# EAGLE design main (EAGLE 9.6.0)
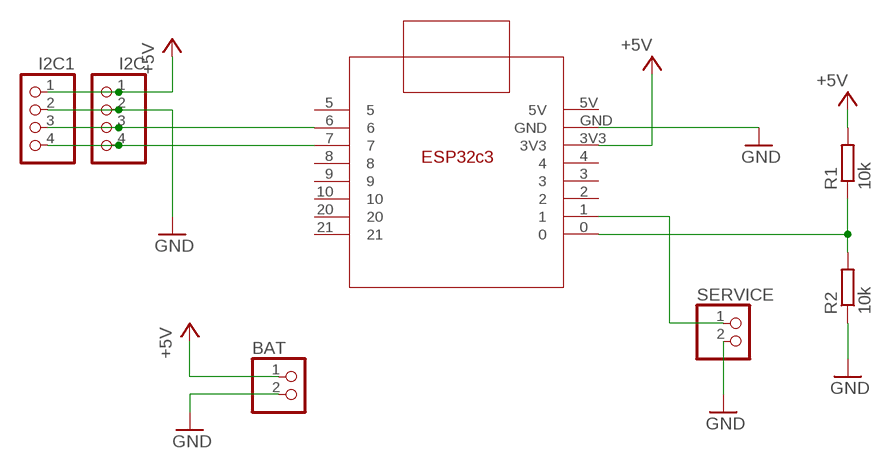
[diagram p0: schematic, sheet 1]

## Parts
BAT  PINHD-1X2  [1X02]
I2C  PINHD-1X4  [1X04]
I2C1  PINHD-1X4  [1X04]
R1  10k  R-EU_R0805  [R0805]
R2  10k  R-EU_R0805  [R0805]
SERVICE  PINHD-1X2  [1X02]
U$2  ESP32C3SMD  [ESP32C3_SMD]

## Nets
+5V: BAT.1 I2C1.1 I2C.1 R1.2 U$2.3V3
GND: BAT.2 I2C1.2 I2C.2 R2.1 SERVICE.2 U$2.GND
N$1: I2C1.3 I2C.3 U$2.6
N$2: R1.1 R2.2 U$2.0
N$3: I2C1.4 I2C.4 U$2.7
N$4: SERVICE.1 U$2.1
Unconnected: U$2.2 U$2.3 U$2.4 U$2.5 U$2.5V U$2.8 U$2.9 U$2.10 U$2.20 U$2.21

## Library data of the parts
BAT SERVICE = pinhead:PINHD-1X2: PIN HEADER
I2C I2C1 = pinhead:PINHD-1X4: PIN HEADER
R1 R2 = resistor:R-EU_: RESISTOR, European symbol
U$2 = ESP32:ESP32C3

## Board
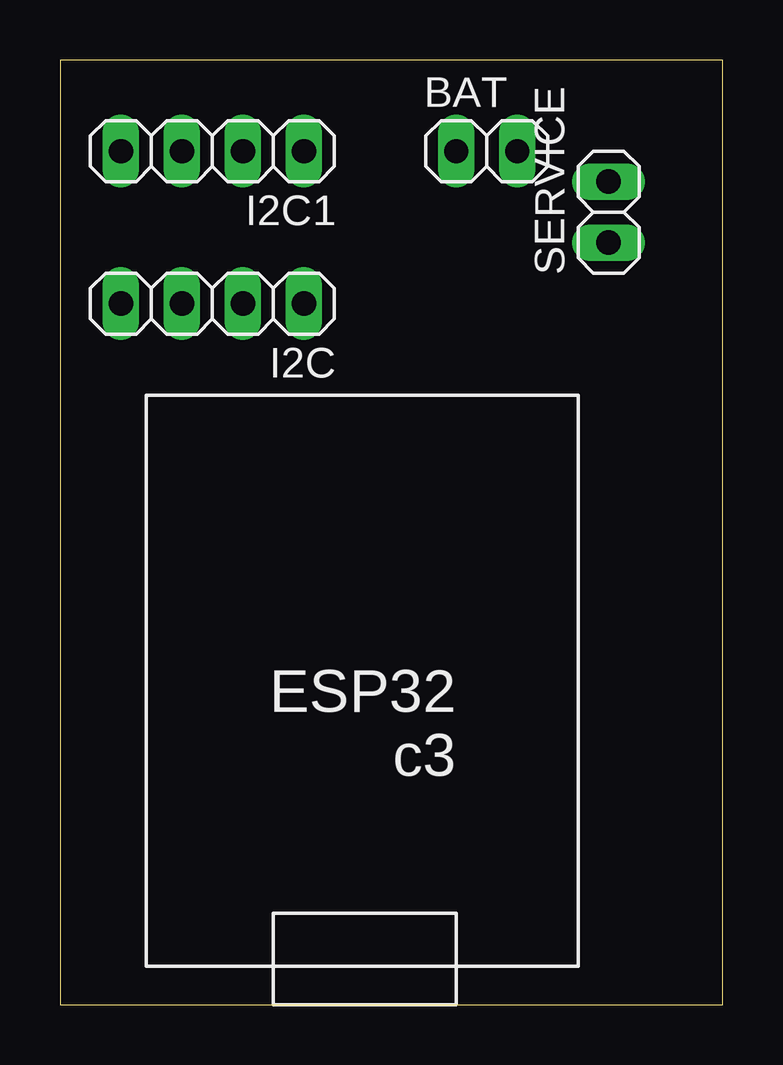
[diagram p1: board, top side]
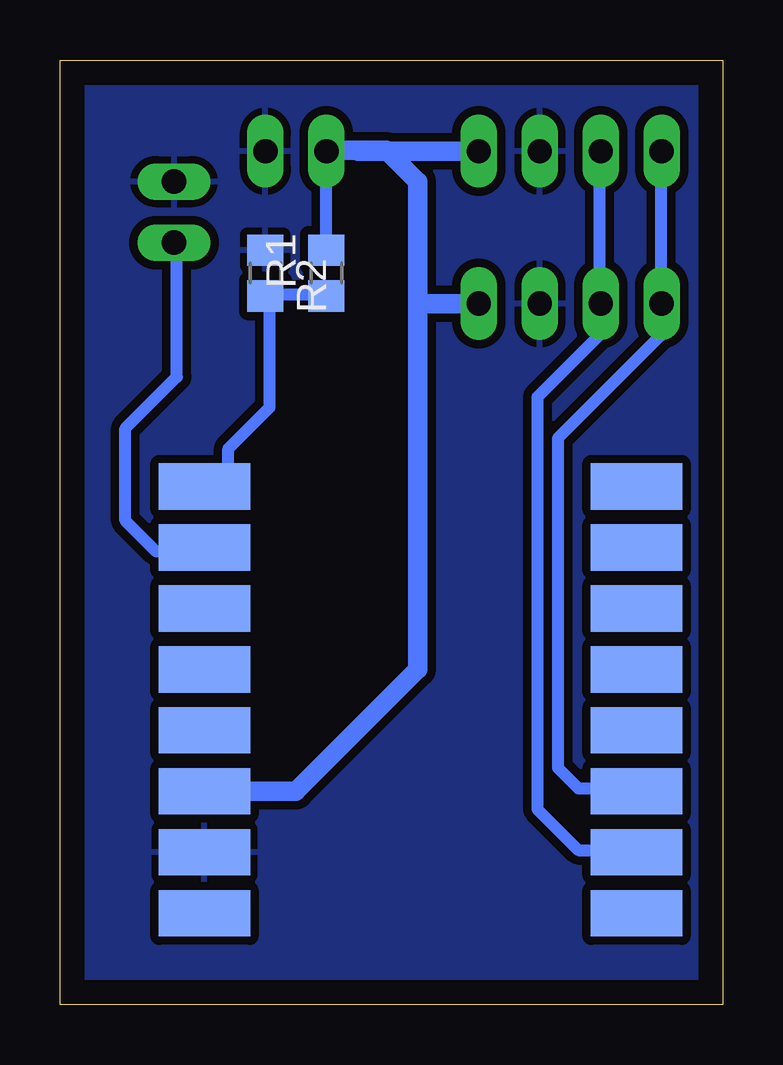
[diagram p2: board, bottom side, seen from below]

Size 27.61 x 39.36 mm. Coordinates in mm from the lower left corner, seen from the top.
Outline: 0,0 27.61,0 27.61,39.36 0,39.36 0,0
Copper layers (1*16): Top 0.035mm / dielectric 1.5mm / Bottom 0.035mm
Design rules "cnc": minimum track width 20mil, minimum drill 0.35mm, track to track 0.35mm, track to pad 0.35mm, pad to pad 0.35mm, via to via 0.35mm, smd to smd 0.35mm, copper to edge 40mil, drill to drill 6mil, minimum pad ring 10mil, minimum via ring 8mil, stop-mask expansion 4mil, vias tented up to drill 0mil, thermal gap 0.3mm

### Footprints (pad centres in the part's own frame; a part is rotated, then mirrored left to right if it is on the bottom)
1X02 = drill 1.016 long: 1 -1.27,0; 2 1.27,0
1X04 = drill 1.016 long: 1 -3.81,0; 2 -1.27,0; 3 1.27,0; 4 3.81,0
R0805 = smd 1.3 x 1.5: 1 -0.95,0; 2 0.95,0
ESP32C3_SMD = smd 3.81 x 1.93 bottom: 0 0,2.54; 1 0,5.08; 2 0,7.62; 3 0,10.16; 3V3 0,15.24; 4 0,12.7; 5 18,20.32; 5V 0,20.32; 6 18,17.78; 7 18,15.24; 8 18,12.7; 9 18,10.16; 10 18,7.62; 20 18,5.08; 21 18,2.54; GND 0,17.78

### Placement (x,y rotation side)
BAT  17.78,35.56 0 top
I2C  6.35,29.21 180 top
I2C1  6.35,35.56 180 top
R1  16.51,30.48 90 bottom
R2  19.05,30.48 270 bottom
SERVICE  22.86,33.02 90 top
U$2  21.59,24.13 180 top

### Tracks (layer width: path | path; a pad name or v marks a point on that pad's centre or on a via)
+5V
  Bottom 0.508: 16.3,35.61 BAT.1 R1.2
  Bottom 0.813: U$2.3V3 17.78,8.89 12.7,13.97 12.7,29.21 | 12.7,29.21 I2C.1 | 12.7,29.21 12.7,34.29 14.02,35.61 15.24,35.61 | 15.24,35.61 16.3,35.61 | I2C1.1 15.19,35.56 15.24,35.61
GND
  pour Bottom: 0,0 0,60.96 67.31,60.96 67.31,0
N$1
  Bottom 0.508: 5.15,29.17 5.15,27.89 7.72,25.31 7.72,8.15 6.01,6.43 3.86,6.43 U$2.6 | 5.15,29.17 I2C.3 | I2C1.3 5.15,35.49 5.15,29.17
N$2
  Bottom 0.508: R1.1 16.73,29.6 18.88,29.6 R2.2 18.88,29.17 18.88,24.88 20.59,23.17 20.59,21.88 21.02,21.45 21.45,21.45 U$2.0
N$3
  Bottom 0.508: 2.57,29.17 2.57,27.89 6.86,23.59 6.86,9.87 6.01,9.01 3.86,9.01 U$2.7 | 2.57,29.17 I2C.4 | I2C1.4 2.57,35.53 2.57,29.17
N$4
  Bottom 0.508: SERVICE.1 22.74,31.75 22.74,26.15 24.88,24.01 24.88,20.16 23.59,18.88 21.88,18.88 U$2.1